# Altium project Audio_Player_V1.1.PrjPcb
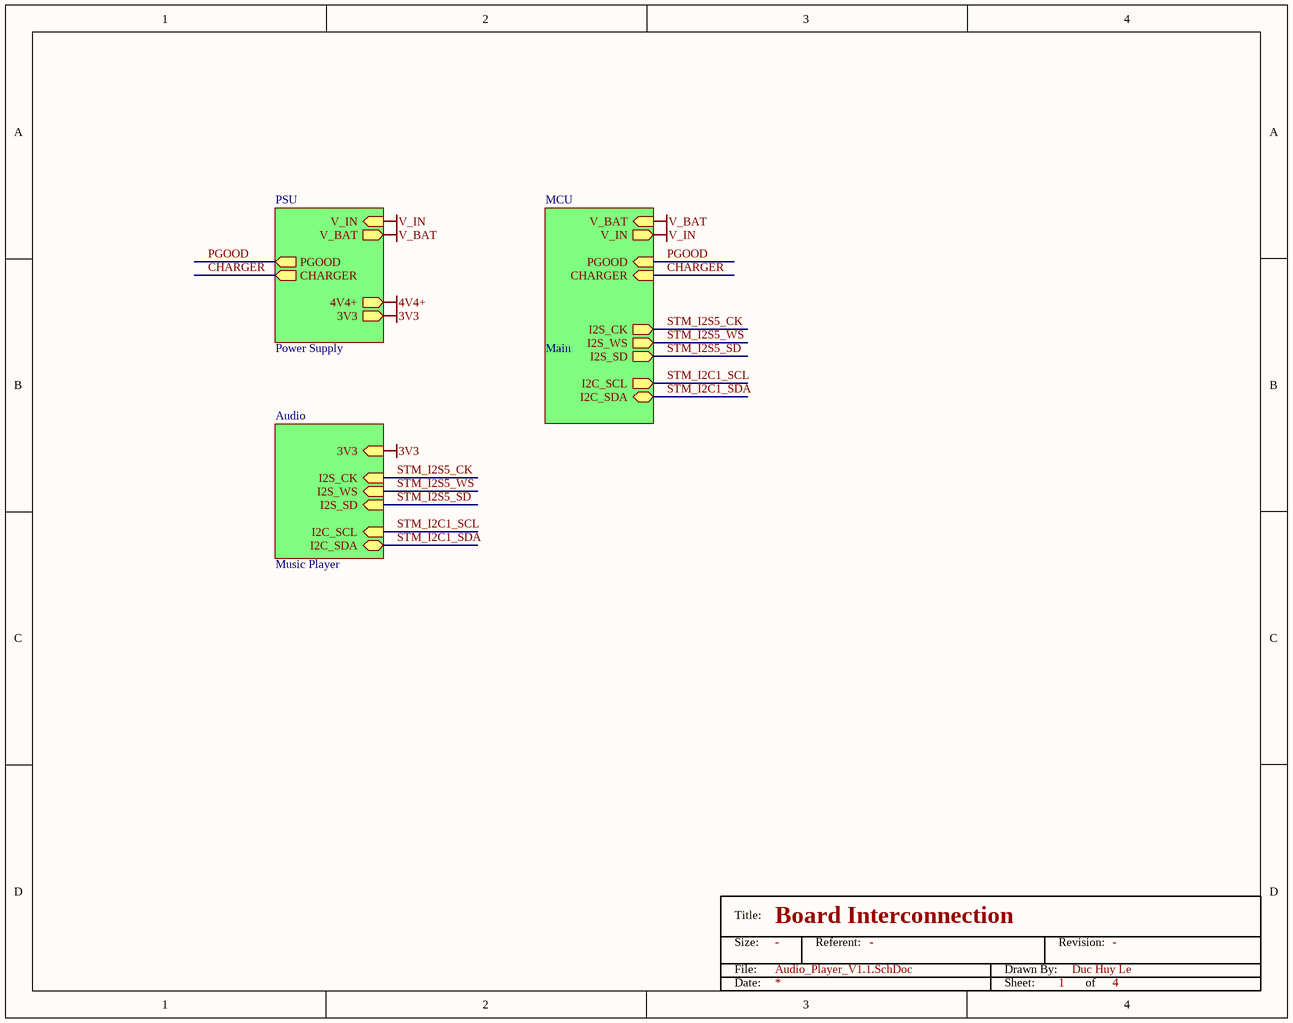
[diagram p0: Audio_Player_V1.1.SchDoc]
4 sheets, 118 parts. Net scope: global (net labels, ports and power ports of the same name join across sheets).
Board file: Audio_Player_V1.1.PcbDoc
Sheets:
  Audio_Player_V1.1.SchDoc
    Power Supply = PSU.SchDoc
    Main = MCU.SchDoc
    Music Player = Audio.SchDoc

## Sheet Audio_Player_V1.1.SchDoc
size A; DrawnBy: Duc Huy Le; SheetNumber: 1; SheetTotal: 4

### Parts
TitleBlock1  Title: Board Interconnection  (hidden comment: Title Block)

### Sub-sheets
Main = MCU: V_IN (out), I2C_SCL (out), I2C_SDA (bidir), I2S_CK (out), I2S_WS (out), I2S_SD (out), V_BAT (in), PGOOD (in), CHARGER (in)
Music Player = Audio: 3V3 (in), I2S_CK (in), I2S_WS (in), I2S_SD (in), I2C_SCL (in), I2C_SDA (bidir)
Power Supply = PSU: V_IN (in), 4V4+ (out), 3V3 (out), V_BAT (out), PGOOD (out), CHARGER (out)

### Nets
3V3: sheet Power Supply/3V3, sheet Music Player/3V3
V_BAT: sheet Power Supply/V_BAT, sheet Main/V_BAT
V_IN: sheet Power Supply/V_IN, sheet Main/V_IN
CHARGER: sheet Power Supply/CHARGER, sheet Main/CHARGER
PGOOD: sheet Power Supply/PGOOD, sheet Main/PGOOD
STM_I2C1_SCL: sheet Main/I2C_SCL, sheet Music Player/I2C_SCL
STM_I2C1_SDA: sheet Main/I2C_SDA, sheet Music Player/I2C_SDA
STM_I2S5_CK: sheet Main/I2S_CK, sheet Music Player/I2S_CK
STM_I2S5_SD: sheet Main/I2S_SD, sheet Music Player/I2S_SD
STM_I2S5_WS: sheet Main/I2S_WS, sheet Music Player/I2S_WS

### Notes on the sheet
- (in symbol Title Block) Title:; Size:; Referent:; Revision:; File:; Drawn By:; Date:; Sheet:; of

### Library data of the parts
TitleBlock1 = Title Block: Revision: -; Referent: -; Size: -

## Sheet PSU.SchDoc
size A; Author: duchuylee; DrawnBy: Duc Huy Le; SheetNumber: 2; SheetTotal: 4
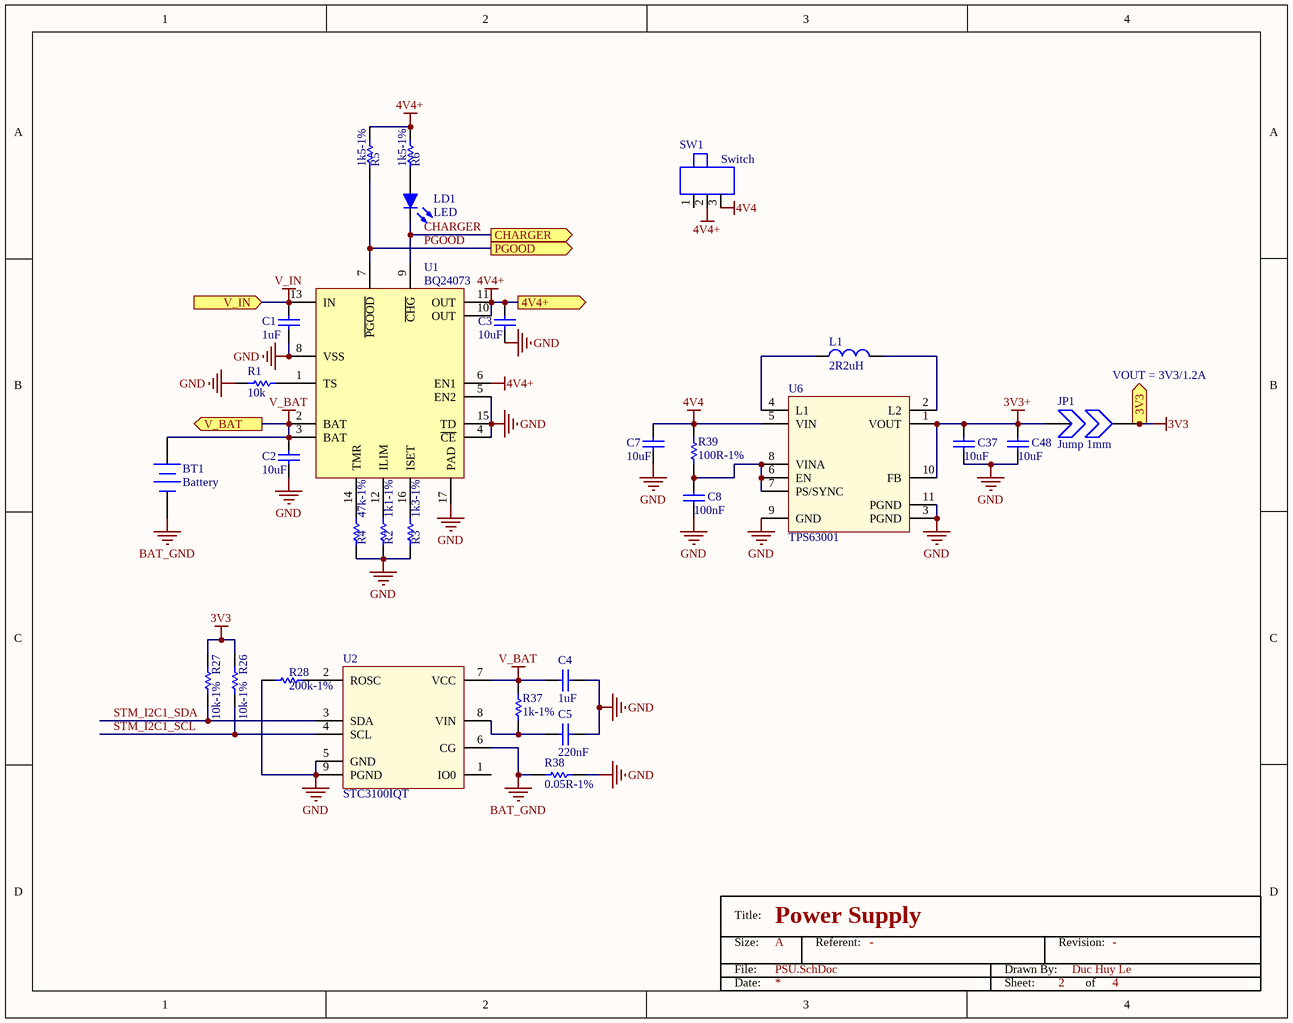
[diagram p1: PSU.SchDoc]

### Parts
BT1  Battery  [BAT-2]
C1  1uF  [Cap 0603]
C2  10uF  [Cap 0603]
C3  10uF  [Cap 0603]
C4  1uF  [Cap 0603]
C5  220nF  [Cap 0603]
C7  10uF  [Cap 0603]
C8  100nF  [Cap 0603]
C37  10uF  [Cap 0603]
C48  10uF  [Cap 0603]
JP1  Jump 1mm  [Jump 1mm]
L1  2R2uH  [Inductor 0520]
LD1  LED  [LED]
R1  10k  [Res 0603]
R2  1k1-1%  [Res 0603]
R3  1k3-1%  [Res 0603]
R4  47k-1%  [Res 0603]
R5  1k5-1%  [Res 0603]
R6  1k5-1%  [Res 0603]
R26  10k-1%  [Res 0603]
R27  10k-1%  [Res 0603]
R28  200k-1%  [Res 0603]
R37  1k-1%  [Res 0603]
R38  0.05R-1%  [Res 2512]
R39  100R-1%  [Res 0603]
SW1  Switch  [Slide switch MSK-38]
TitleBlock2  Title: Power Supply  Size: A  (hidden comment: Title Block)
U1  BQ24073  [QFN-16]
U2  STC3100IQT  [DFN-8 3x3]
U6  TPS63001  [VSON-10 3x3]

### Ports
3V3 (out), 4V4+ (out), CHARGER (out), PGOOD (out), V_BAT (out), V_IN (in)

### Nets
3V3: JP1.2 R26.1 R27.1 ; port 3V3
3V3+: C37.2 C48.2 JP1.1 U6.1(VOUT) U6.10(FB)
4V4: C7.2 R39.2 SW1.3(A3) U6.5(VIN)
4V4+: C3.2 R5.2 R6.2 SW1.2(A2) U1.6(EN1) U1.10(OUT) U1.11(OUT) ; port 4V4+
BAT_GND: BT1.2(-) R38.1 U2.6(CG)
GND: C1.1 C2.1 C3.1 C4.1 C5.1 C7.1 C8.1 C37.1 C48.1 R1.1 R2.1 R3.1 R4.1 R28.1 R38.2 U1.4(~{CE}) U1.5(EN2) U1.8(VSS) U1.15(TD) U1.17(PAD) U2.5(GND) U2.9(PGND) U6.3(PGND) U6.9(GND) U6.11(PGND)
V_BAT: BT1.1(+) C2.2 C4.2 R37.2 U1.2(BAT) U1.3(BAT) U2.7(VCC) ; port V_BAT
V_IN: C1.2 U1.13(IN) ; port V_IN
CHARGER: LD1.2(K) U1.9(~{CHG}) ; port CHARGER
PGOOD: R5.1 U1.7(~{PGOOD}) ; port PGOOD
STM_I2C1_SCL: R26.2 U2.4(SCL)
STM_I2C1_SDA: R27.2 U2.3(SDA)
NetC5_2: C5.2 R37.1 U2.8(VIN)
NetC8_2: C8.2 R39.1 U6.6(EN) U6.7(PS/SYNC) U6.8(VINA)
NetL1_1: L1.1 U6.4(L1)
NetL1_2: L1.2 U6.2(L2)
NetLD1_1: LD1.1(A) R6.1
NetR1_2: R1.2 U1.1(TS)
NetR2_2: R2.2 U1.12(ILIM)
NetR3_2: R3.2 U1.16(ISET)
NetR4_2: R4.2 U1.14(TMR)
NetR28_2: R28.2 U2.2(ROSC)

Not connected (* = marked no-connect by the designer): SW1 1(A1); U2 1(IO0)

### Notes on the sheet
- (near JP1) VOUT = 3V3/1.2A
- (in symbol Title Block) Title:; Size:; Referent:; Revision:; File:; Drawn By:; Date:; Sheet:; of

### Library data of the parts
BT1 = Battery: Multicell Battery; Published: 24-Mar-1999; LatestRevisionDate: 17-Jul-2002; LatestRevisionNote: Re-released for DXP Platform.; PackageReference: BAT-2; Publisher: Altium Limited; PackageDescription: Battery; 2 Leads
C1-C5 C7 C8 C37 C48 = Cap: Cap SMD
JP1 = Jump
L1 = Inductor: L- SMD
R1-R6 R26-R28 R37-R39 = Res: Res SMD
SW1 = SW 3: MSK-38 Slide switch 3 pin
U1 = BQ24073: Li-Ion Battery Charger
U2 = STC3100: Battery monitor IC with Coulomb counter/gas gauge
U6 = TPS63001: TPS6300x High-Efficient Single Inductor Buck-Boost Converter With 1.8-A Switches
LD1 = LED: Name: LED
TitleBlock2 = Title Block: Revision: -; Referent: -

## Sheet MCU.SchDoc
size B; DrawnBy: Duc Huy Le; SheetNumber: 3; SheetTotal: 4
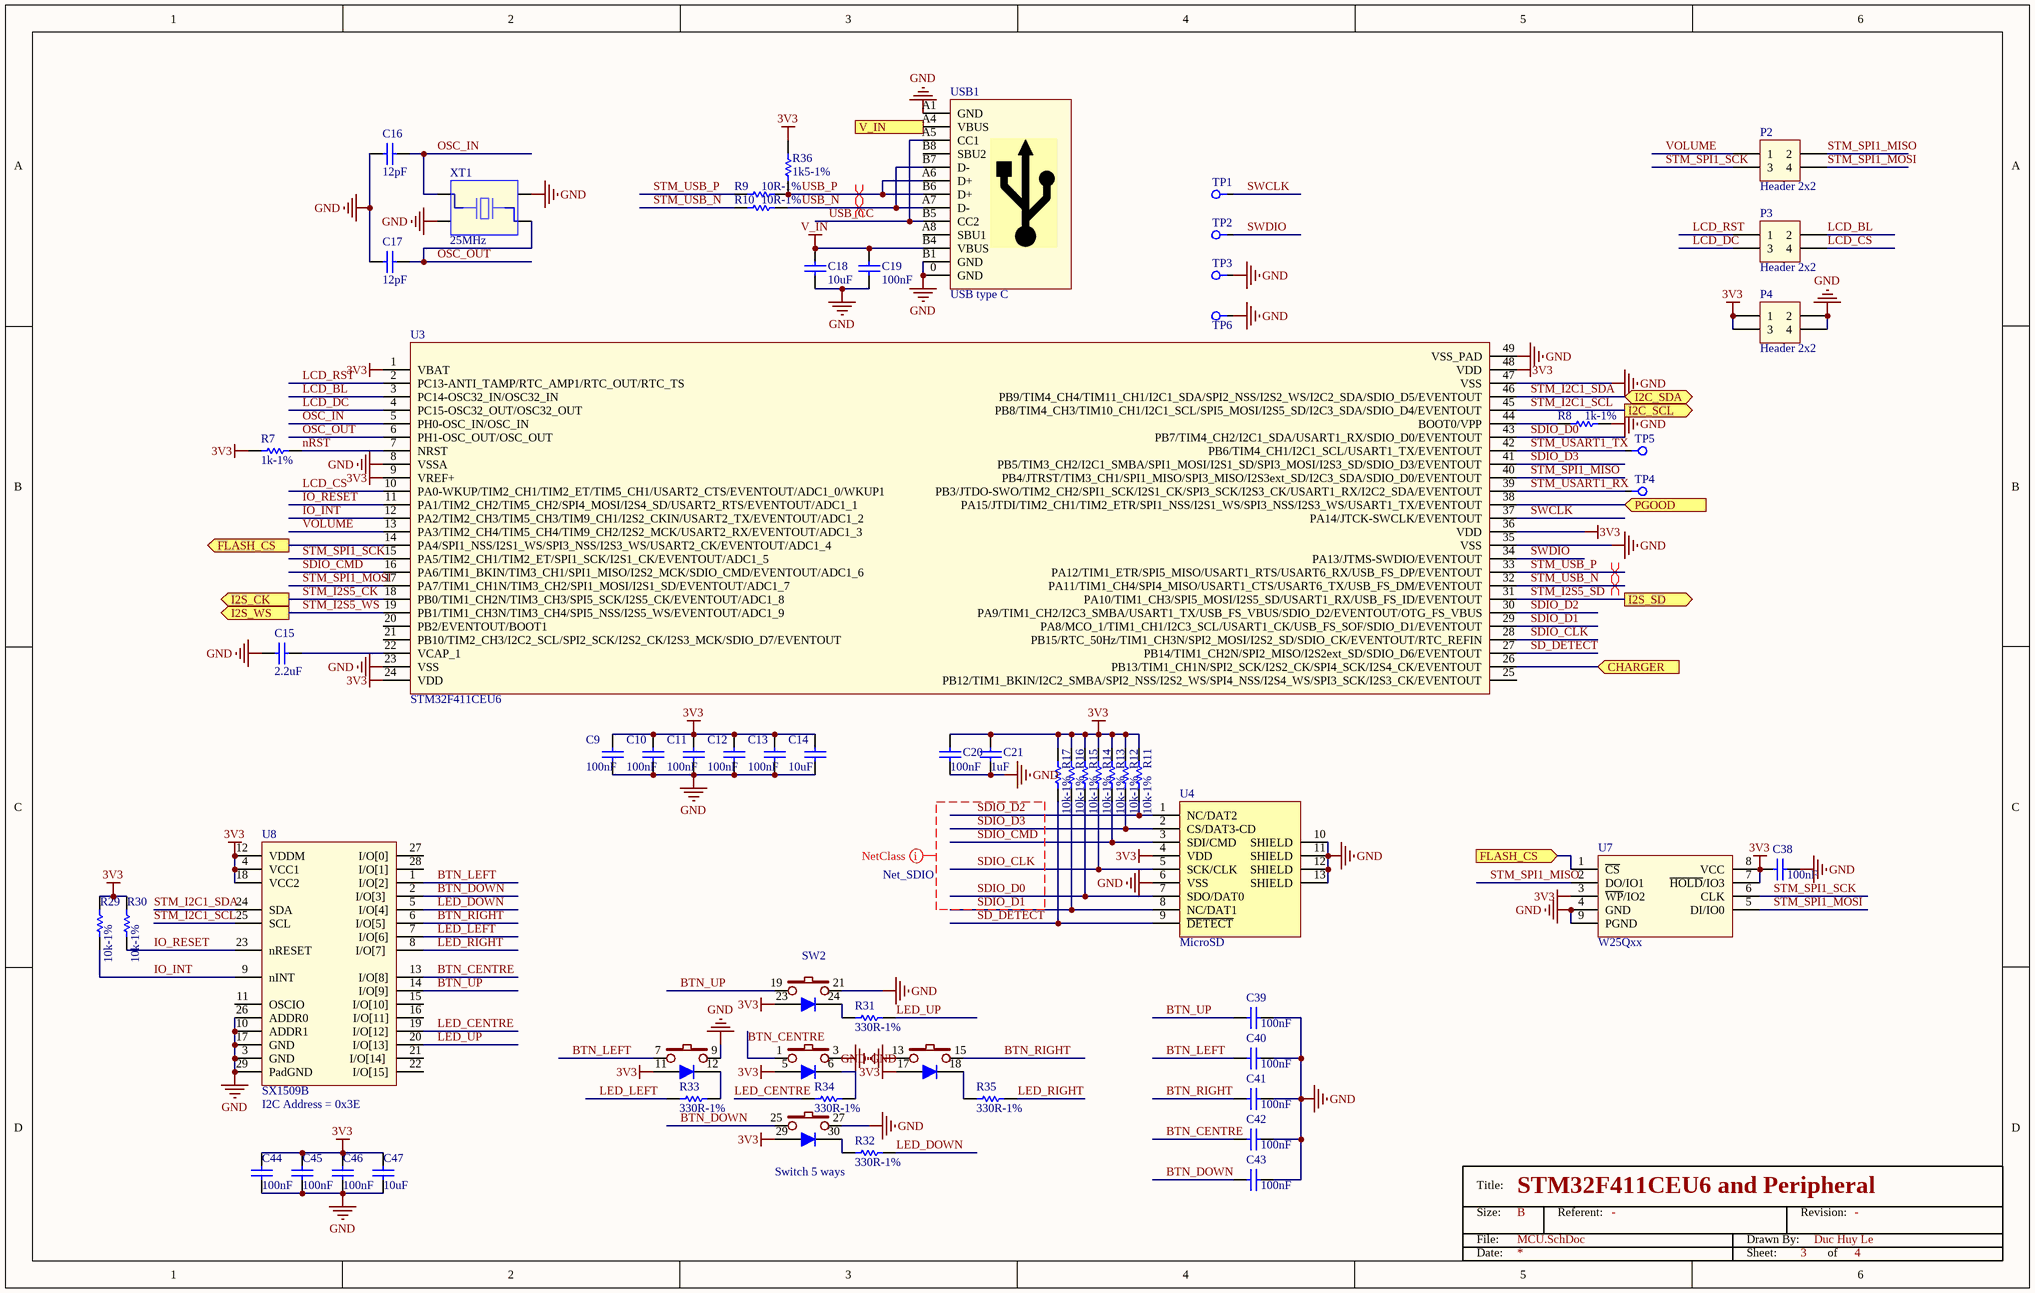
[diagram p2: MCU.SchDoc]

### Parts
C9  100nF  [Cap 0603]
C10  100nF  [Cap 0603]
C11  100nF  [Cap 0603]
C12  100nF  [Cap 0603]
C13  100nF  [Cap 0603]
C14  10uF  [Cap 0603]
C15  2.2uF  [Cap 0603]
C16  12pF  [Cap 0603]
C17  12pF  [Cap 0603]
C18  10uF  [Cap 0603]
C19  100nF  [Cap 0603]
C20  100nF  [Cap 0603]
C21  1uF  [Cap 0603]
C38  100nF  [Cap 0603]
C39  100nF  [Cap 0603]
C40  100nF  [Cap 0603]
C41  100nF  [Cap 0603]
C42  100nF  [Cap 0603]
C43  100nF  [Cap 0603]
C44  100nF  [Cap 0603]
C45  100nF  [Cap 0603]
C46  100nF  [Cap 0603]
C47  10uF  [Cap 0603]
P2  Header 2x2  [Header 2mm 2x2]
P3  Header 2x2  [Header 2mm 2x2]
P4  Header 2x2  [Header 2mm 2x2]
R7  1k-1%  [Res 0603]
R8  1k-1%  [Res 0603]
R9  10R-1%  [Res 0603]
R10  10R-1%  [Res 0603]
R11  10k-1%  [Res 0603]
R12  10k-1%  [Res 0603]
R13  10k-1%  [Res 0603]
R14  10k-1%  [Res 0603]
R15  10k-1%  [Res 0603]
R16  10k-1%  [Res 0603]
R17  10k-1%  [Res 0603]
R29  10k-1%  [Res 0603]
R30  10k-1%  [Res 0603]
R31  330R-1%  [Res 0603]
R32  330R-1%  [Res 0603]
R33  330R-1%  [Res 0603]
R34  330R-1%  [Res 0603]
R35  330R-1%  [Res 0603]
R36  1k5-1%  [Res 0603]
SW2  Switch 5 ways  [Switch 5 ways]
TitleBlock3  Title: STM32F411CEU6 and Peripheral  Size: B  (hidden comment: Title Block)
TP1  TP  [TP]  (value not drawn)
TP2  TP  [TP]  (value not drawn)
TP3  TP  [TP]  (value not drawn)
TP4  TP  [TP]  (value not drawn)
TP5  TP  [TP]  (value not drawn)
TP6  TP  [TP]  (value not drawn)
U3  STM32F411CEU6  [UFQFPN-48]
U4  MicroSD  [MicroSD A]
U7  W25Qxx  [WSON 6x5]
U8  SX1509B  [QFN-28 4x4]
USB1  USB type C  [USB Type C]
XT1  25MHz  [Crystal 3225]

### Ports
CHARGER (in), FLASH_CS (in), FLASH_CS (out), I2C_SCL (out), I2C_SDA (bidir), I2S_CK (out), I2S_SD (out), I2S_WS (out), PGOOD (in), V_IN (out)

### Nets
3V3: C9.2 C10.2 C11.2 C12.2 C13.2 C14.2 C20.1 C21.1 C38.2 C44.2 C45.2 C46.2 C47.2 P4.1 P4.3 R7.2 R11.1 R12.1 R13.1 R14.1 R15.1 R16.1 R17.1 R29.1 R30.1 R36.2 SW2.5(A) SW2.11(A) SW2.17(A) SW2.23(A) SW2.29(A) U3.1(VBAT) U3.9(VREF+) U3.24(VDD) U3.36(VDD) U3.48(VDD) U4.4(VDD) U7.3(~{WP}/IO2) U7.7(~{HOLD}/IO3) U7.8(VCC) U8.4(VCC1) U8.12(VDDM) U8.18(VCC2)
GND: C9.1 C10.1 C11.1 C12.1 C13.1 C14.1 C15.2 C16.2 C17.2 C18.2 C19.2 C20.2 C21.2 C38.1 C39.1 C40.1 C41.1 C42.1 C43.1 C44.1 C45.1 C46.1 C47.1 P4.2 P4.4 R8.1 SW2.3 SW2.9 SW2.13 SW2.21 SW2.27 TP3.1 TP6.1 U3.8(VSSA) U3.23(VSS) U3.35(VSS) U3.47(VSS) U3.49(VSS_PAD) U4.6(VSS) U4.10(SHIELD) U4.11(SHIELD) U4.12(SHIELD) U4.13(SHIELD) U7.4(GND) U7.9(PGND) U8.3(GND) U8.10(ADDR1) U8.17(GND) U8.26(ADDR0) U8.29(PadGND) USB1.0(GND) USB1.A1(GND) USB1.B1(GND) XT1.2 XT1.4
V_IN: C18.1 C19.1 USB1.A4(VBUS) USB1.B4(VBUS) ; port V_IN
BTN_CENTRE: C42.2 SW2.1 U8.13(I/O[8])
BTN_DOWN: C43.2 SW2.25 U8.2(I/O[3])
BTN_LEFT: C40.2 SW2.7 U8.1(I/O[2])
BTN_RIGHT: C41.2 SW2.15 U8.6(I/O[5])
BTN_UP: C39.2 SW2.19 U8.14(I/O[9])
CHARGER: U3.26(PB13/TIM1_CH1N/SPI2_SCK/I2S2_CK/SPI4_SCK/I2S4_CK/EVENTOUT) ; port CHARGER
FLASH_CS: U3.14(PA4/SPI1_NSS/I2S1_WS/SPI3_NSS/I2S3_WS/USART2_CK/EVENTOUT/ADC1_4) U7.1(~{CS}) ; port FLASH_CS
IO_INT: R29.2 U3.12(PA2/TIM2_CH3/TIM5_CH3/TIM9_CH1/I2S2_CKIN/USART2_TX/EVENTOUT/ADC1_2) U8.9(nINT)
IO_RESET: R30.2 U3.11(PA1/TIM2_CH2/TIM5_CH2/SPI4_MOSI/I2S4_SD/USART2_RTS/EVENTOUT/ADC1_1) U8.23(nRESET)
LCD_BL: P3.2 U3.3(PC14-OSC32_IN/OSC32_IN)
LCD_CS: P3.4 U3.10(PA0-WKUP/TIM2_CH1/TIM2_ET/TIM5_CH1/USART2_CTS/EVENTOUT/ADC1_0/WKUP1)
LCD_DC: P3.3 U3.4(PC15-OSC32_OUT/OSC32_OUT)
LCD_RST: P3.1 U3.2(PC13-ANTI_TAMP/RTC_AMP1/RTC_OUT/RTC_TS)
LED_CENTRE: R34.1 U8.19(I/O[12])
LED_DOWN: R32.2 U8.5(I/O[4])
LED_LEFT: R33.1 U8.7(I/O[6])
LED_RIGHT: R35.2 U8.8(I/O[7])
LED_UP: R31.2 U8.20(I/O[13])
nRST: R7.1 U3.7(NRST)
OSC_IN: C16.1 U3.5(PH0-OSC_IN/OSC_IN) XT1.1
OSC_OUT: C17.1 U3.6(PH1-OSC_OUT/OSC_OUT) XT1.3
PGOOD: U3.38(PA15/JTDI/TIM2_CH1/TIM2_ETR/SPI1_NSS/I2S1_WS/SPI3_NSS/I2S3_WS/USART1_TX/EVENTOUT) ; port PGOOD
SD_DETECT: R17.2 U3.27(PB14/TIM1_CH2N/SPI2_MISO/I2S2ext_SD/SDIO_D6/EVENTOUT) U4.9(~{DETECT})
SDIO_CLK: R14.2 U3.28(PB15/RTC_50Hz/TIM1_CH3N/SPI2_MOSI/I2S2_SD/SDIO_CK/EVENTOUT/RTC_REFIN) U4.5(SCK/CLK)
SDIO_CMD: R13.2 U3.16(PA6/TIM1_BKIN/TIM3_CH1/SPI1_MISO/I2S2_MCK/SDIO_CMD/EVENTOUT/ADC1_6) U4.3(SDI/CMD)
SDIO_D0: R15.2 U3.43(PB7/TIM4_CH2/I2C1_SDA/USART1_RX/SDIO_D0/EVENTOUT) U4.7(SDO/DAT0)
SDIO_D1: R16.2 U3.29(PA8/MCO_1/TIM1_CH1/I2C3_SCL/USART1_CK/USB_FS_SOF/SDIO_D1/EVENTOUT) U4.8(NC/DAT1)
SDIO_D2: R11.2 U3.30(PA9/TIM1_CH2/I2C3_SMBA/USART1_TX/USB_FS_VBUS/SDIO_D2/EVENTOUT/OTG_FS_VBUS) U4.1(NC/DAT2)
SDIO_D3: R12.2 U3.41(PB5/TIM3_CH2/I2C1_SMBA/SPI1_MOSI/I2S1_SD/SPI3_MOSI/I2S3_SD/SDIO_D3/EVENTOUT) U4.2(CS/DAT3-CD)
STM_I2C1_SCL: U3.45(PB8/TIM4_CH3/TIM10_CH1/I2C1_SCL/SPI5_MOSI/I2S5_SD/I2C3_SDA/SDIO_D4/EVENTOUT) U8.25(SCL) ; port I2C_SCL
STM_I2C1_SDA: U3.46(PB9/TIM4_CH4/TIM11_CH1/I2C1_SDA/SPI2_NSS/I2S2_WS/I2C2_SDA/SDIO_D5/EVENTOUT) U8.24(SDA) ; port I2C_SDA
STM_I2S5_CK: U3.18(PB0/TIM1_CH2N/TIM3_CH3/SPI5_SCK/I2S5_CK/EVENTOUT/ADC1_8) ; port I2S_CK
STM_I2S5_SD: U3.31(PA10/TIM1_CH3/SPI5_MOSI/I2S5_SD/USART1_RX/USB_FS_ID/EVENTOUT) ; port I2S_SD
STM_I2S5_WS: U3.19(PB1/TIM1_CH3N/TIM3_CH4/SPI5_NSS/I2S5_WS/EVENTOUT/ADC1_9) ; port I2S_WS
STM_SPI1_MISO: P2.2 U3.40(PB4/JTRST/TIM3_CH1/SPI1_MISO/SPI3_MISO/I2S3ext_SD/I2C3_SDA/SDIO_D0/EVENTOUT) U7.2(DO/IO1)
STM_SPI1_MOSI: P2.4 U3.17(PA7/TIM1_CH1N/TIM3_CH2/SPI1_MOSI/I2S1_SD/EVENTOUT/ADC1_7) U7.5(DI/IO0)
STM_SPI1_SCK: P2.3 U3.15(PA5/TIM2_CH1/TIM2_ET/SPI1_SCK/I2S1_CK/EVENTOUT/ADC1_5) U7.6(CLK)
STM_USART1_RX: TP4.1 U3.39(PB3/JTDO-SWO/TIM2_CH2/SPI1_SCK/I2S1_CK/SPI3_SCK/I2S3_CK/USART1_RX/I2C2_SDA/EVENTOUT)
STM_USART1_TX: TP5.1 U3.42(PB6/TIM4_CH1/I2C1_SCL/USART1_TX/EVENTOUT)
STM_USB_N: R10.2 U3.32(PA11/TIM1_CH4/SPI4_MISO/USART1_CTS/USART6_TX/USB_FS_DM/EVENTOUT)
STM_USB_P: R9.2 U3.33(PA12/TIM1_ETR/SPI5_MISO/USART1_RTS/USART6_RX/USB_FS_DP/EVENTOUT)
SWCLK: TP1.1 U3.37(PA14/JTCK-SWCLK/EVENTOUT)
SWDIO: TP2.1 U3.34(PA13/JTMS-SWDIO/EVENTOUT)
USB_CC: USB1.A5(CC1) USB1.B5(CC2)
USB_N: R10.1 USB1.A7(D-) USB1.B7(D-)
USB_P: R9.1 R36.1 USB1.A6(D+) USB1.B6(D+)
VOLUME: P2.1 U3.13(PA3/TIM2_CH4/TIM5_CH4/TIM9_CH2/I2S2_MCK/USART2_RX/EVENTOUT/ADC1_3)
NetC15_1: C15.1 U3.22(VCAP_1)
NetR8_2: R8.2 U3.44(BOOT0/VPP)
NetR31_1: R31.1 SW2.24(K)
NetR32_1: R32.1 SW2.30(K)
NetR33_2: R33.2 SW2.12(K)
NetR34_2: R34.2 SW2.6(K)
NetR35_1: R35.1 SW2.18(K)

Not connected (* = marked no-connect by the designer): U3 20(PB2/EVENTOUT/BOOT1) 21(PB10/TIM2_CH3/I2C2_SCL/SPI2_SCK/I2S2_CK/I2S3_MCK/SDIO_D7/EVENTOUT) 25(PB12/TIM1_BKIN/I2C2_SMBA/SPI2_NSS/I2S2_WS/SPI4_NSS/I2S4_WS/SPI3_SCK/I2S3_CK/EVENTOUT); U8 11(OSCIO) 15(I/O[10]) 16(I/O[11]) 21(I/O[14]_) 22(I/O[15]) 27(I/O[0]) 28(I/O[1]); USB1 A8(SBU1) B8(SBU2)

### Layout directives
differential pair; differential pair class Diff_USB: STM_USB_N, STM_USB_P
differential pair: USB_N, USB_P
net class Net_SDIO: SDIO_CLK, SDIO_CMD, SDIO_D0, SDIO_D1, SDIO_D2, SDIO_D3

### Notes on the sheet
- (near U8) I2C Address = 0x3E
- (in symbol Title Block) Title:; Size:; Referent:; Revision:; File:; Drawn By:; Date:; Sheet:; of

### Library data of the parts
C9-C21 C38-C47 = Cap: Cap SMD
R7-R17 R29-R36 = Res: Res SMD
SW2 = Switch 5 ways: Switch 5 ways: left, right, up, down, centre; pin to pad: 1>1+2 3>3+4 7>7+8 9>9+10 13>13+14 15>15+16 19>19+20 21>21+22 25>25+26 27>27+28
U3 = STM32F411CEU6: UFQFPN48 Arm® Cortex®-M4 32b MCU+FPU, 125 DMIPS, 512KB Flash, / 128KB RAM, USB OTG FS, 11 TIMs, 1 ADC, 13 comm. interfaces
U4 = MicroSD-A: MicroSD Push-Push A
U7 = W25Qxx: Flash Memory SPI Interface
U8 = SX1509B: SX1509B 16-channel I2C GPIO with LED Driver and Keypad Engine
USB1 = USB type C: USB type C 16 Pins
XT1 = XT4: Xtal 4 pins SMD
TitleBlock3 = Title Block: Revision: -; Referent: -

## Sheet Audio.SchDoc
size A; DrawnBy: Duc Huy Le; SheetNumber: 4; SheetTotal: 4
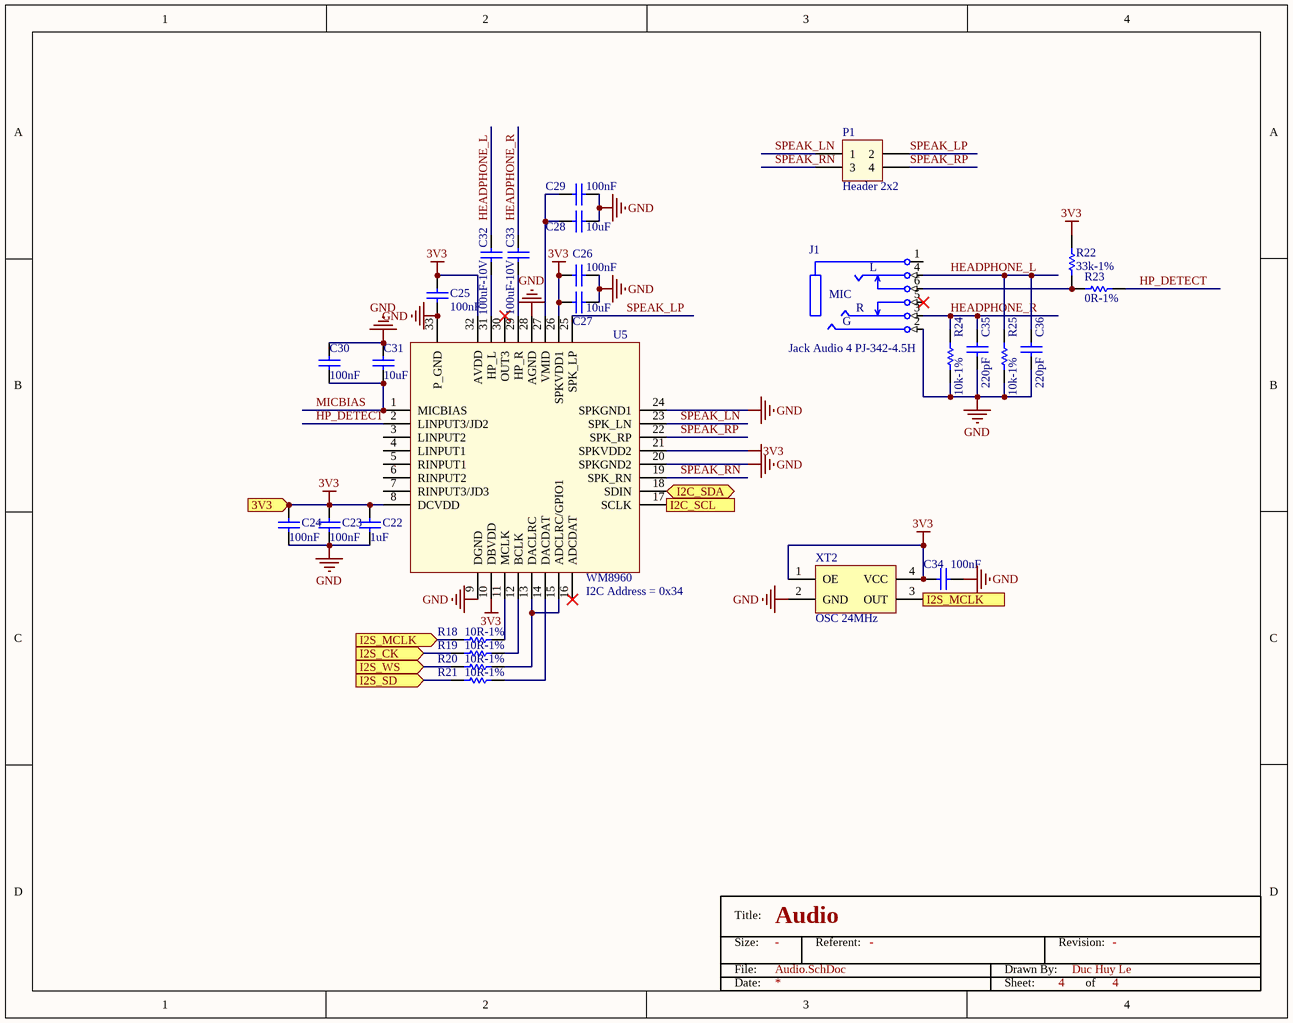
[diagram p3: Audio.SchDoc]

### Parts
C22  1uF  [Cap 0603]
C23  100nF  [Cap 0603]
C24  100nF  [Cap 0603]
C25  100nF  [Cap 0603]
C26  100nF  [Cap 0603]
C27  10uF  [Cap 0603]
C28  10uF  [Cap 0603]
C29  100nF  [Cap 0603]
C30  100nF  [Cap 0603]
C31  10uF  [Cap 0603]
C32  100uF-10V  [Cap 1210]
C33  100uF-10V  [Cap 1210]
C34  100nF  [Cap 0603]
C35  220pF  [Cap 0603]
C36  220pF  [Cap 0603]
J1  Jack Audio 4 PJ-342-4.5H  [PJ-342]
P1  Header 2x2  [Header 2mm 2x2]
R18  10R-1%  [Res 0603]
R19  10R-1%  [Res 0603]
R20  10R-1%  [Res 0603]
R21  10R-1%  [Res 0603]
R22  33k-1%  [Res 0603]
R23  0R-1%  [Res 0603]
R24  10k-1%  [Res 0603]
R25  10k-1%  [Res 0603]
TitleBlock4  Title: Audio  (hidden comment: Title Block)
U5  WM8960  [QFN-32 5X5]
XT2  OSC 24MHz  [Crystal 3225]

### Ports
3V3 (in), I2C_SCL (in), I2C_SDA (bidir), I2S_CK (in), I2S_MCLK (in), I2S_MCLK (out), I2S_SD (in), I2S_WS (in)

### Nets
3V3: C22.1 C23.1 C24.1 C25.1 C26.1 C27.1 C34.1 R22.2 U5.8(DCVDD) U5.10(DBVDD) U5.21(SPKVDD2) U5.26(SPKVDD1) U5.32(AVDD) XT2.1(OE) XT2.4(VCC) ; port 3V3
GND: C22.2 C23.2 C24.2 C25.2 C26.2 C27.2 C28.2 C29.2 C30.2 C31.2 C34.2 C35.1 C36.1 J1.2(R) R24.2 R25.2 U5.9(DGND) U5.20(SPKGND2) U5.24(SPKGND1) U5.28(AGND) U5.33(P_GND) XT2.2(GND)
HEADPHONE_L: C32.2 C36.2 J1.4(T) R25.1
HEADPHONE_R: C33.2 C35.2 J1.3(R) R24.1
HP_DETECT: R23.1 U5.2(LINPUT3/JD2)
I2S_MCLK: R18.1 XT2.3(OUT) ; port I2S_MCLK
MICBIAS: C30.1 C31.1 U5.1(MICBIAS)
SPEAK_LN: P1.1 U5.23(SPK_LN)
SPEAK_LP: P1.2 U5.25(SPK_LP)
SPEAK_RN: P1.3 U5.19(SPK_RN)
SPEAK_RP: P1.4 U5.22(SPK_RP)
STM_I2C1_SCL: U5.17(SCLK) ; port I2C_SCL
STM_I2C1_SDA: U5.18(SDIN) ; port I2C_SDA
STM_I2S5_CK: R19.1 ; port I2S_CK
STM_I2S5_SD: R21.1 ; port I2S_SD
STM_I2S5_WS: R20.1 ; port I2S_WS
NetC28_1: C28.1 C29.1 U5.27(VMID)
NetC32_1: C32.1 U5.31(HP_L)
NetC33_1: C33.1 U5.29(HP_R)
NetJ1_6: J1.6(T) R22.1 R23.2
NetR18_2: R18.2 U5.11(MCLK)
NetR19_2: R19.2 U5.12(BCLK)
NetR20_2: R20.2 U5.13(DACLRC) U5.15(ADCLRC/GPIO1)
NetR21_2: R21.2 U5.14(DACDAT)

Not connected (* = marked no-connect by the designer): J1 1(S) 5(T)*; U5 3(LINPUT2) 4(LINPUT1) 5(RINPUT1) 6(RINPUT2) 7(RINPUT3/JD3) 16(ADCDAT)* 30(OUT3)*

### Notes on the sheet
- (near U5) I2C Address = 0x34
- (in symbol Jack Audio 4 PJ-342-4.5H) L; MIC; G
- (in symbol Title Block) Title:; Size:; Referent:; Revision:; File:; Drawn By:; Date:; Sheet:; of

### Library data of the parts
C22-C36 = Cap: Cap SMD
J1 = Jack Audio 4 PJ-342-4.5H: Jack Audio 3.5 4 pole CTIA use for: Samsung, Apple, Sony
R18-R25 = Res: Res SMD
U5 = WM8960: Stereo CODEC with 1W Stereo Class D Speaker Drivers and Headphone Drivers for Portable Audio Applications
XT2 = XTAL- 4 Pins: Xtal - OSC
TitleBlock4 = Title Block: Revision: -; Referent: -; Size: -

## Nets that join several sheets
3V3: PSU (JP1.2 R26.1 R27.1), MCU (43 pins), Audio (15 pins)
GND: PSU (25 pins), MCU (55 pins), Audio (22 pins)
V_IN: PSU (C1.2 U1.13), MCU (C18.1 C19.1 USB1.A4 USB1.B4)
CHARGER: PSU (LD1.2 U1.9), MCU (U3.26)
PGOOD: PSU (R5.1 U1.7), MCU (U3.38)
STM_I2C1_SCL: PSU (R26.2 U2.4), MCU (U3.45 U8.25), Audio (U5.17)
STM_I2C1_SDA: PSU (R27.2 U2.3), MCU (U3.46 U8.24), Audio (U5.18)
STM_I2S5_CK: MCU (U3.18), Audio (R19.1)
STM_I2S5_SD: MCU (U3.31), Audio (R21.1)
STM_I2S5_WS: MCU (U3.19), Audio (R20.1)